# EAGLE design WiFiDMX4Channel (EAGLE 9.4.2)
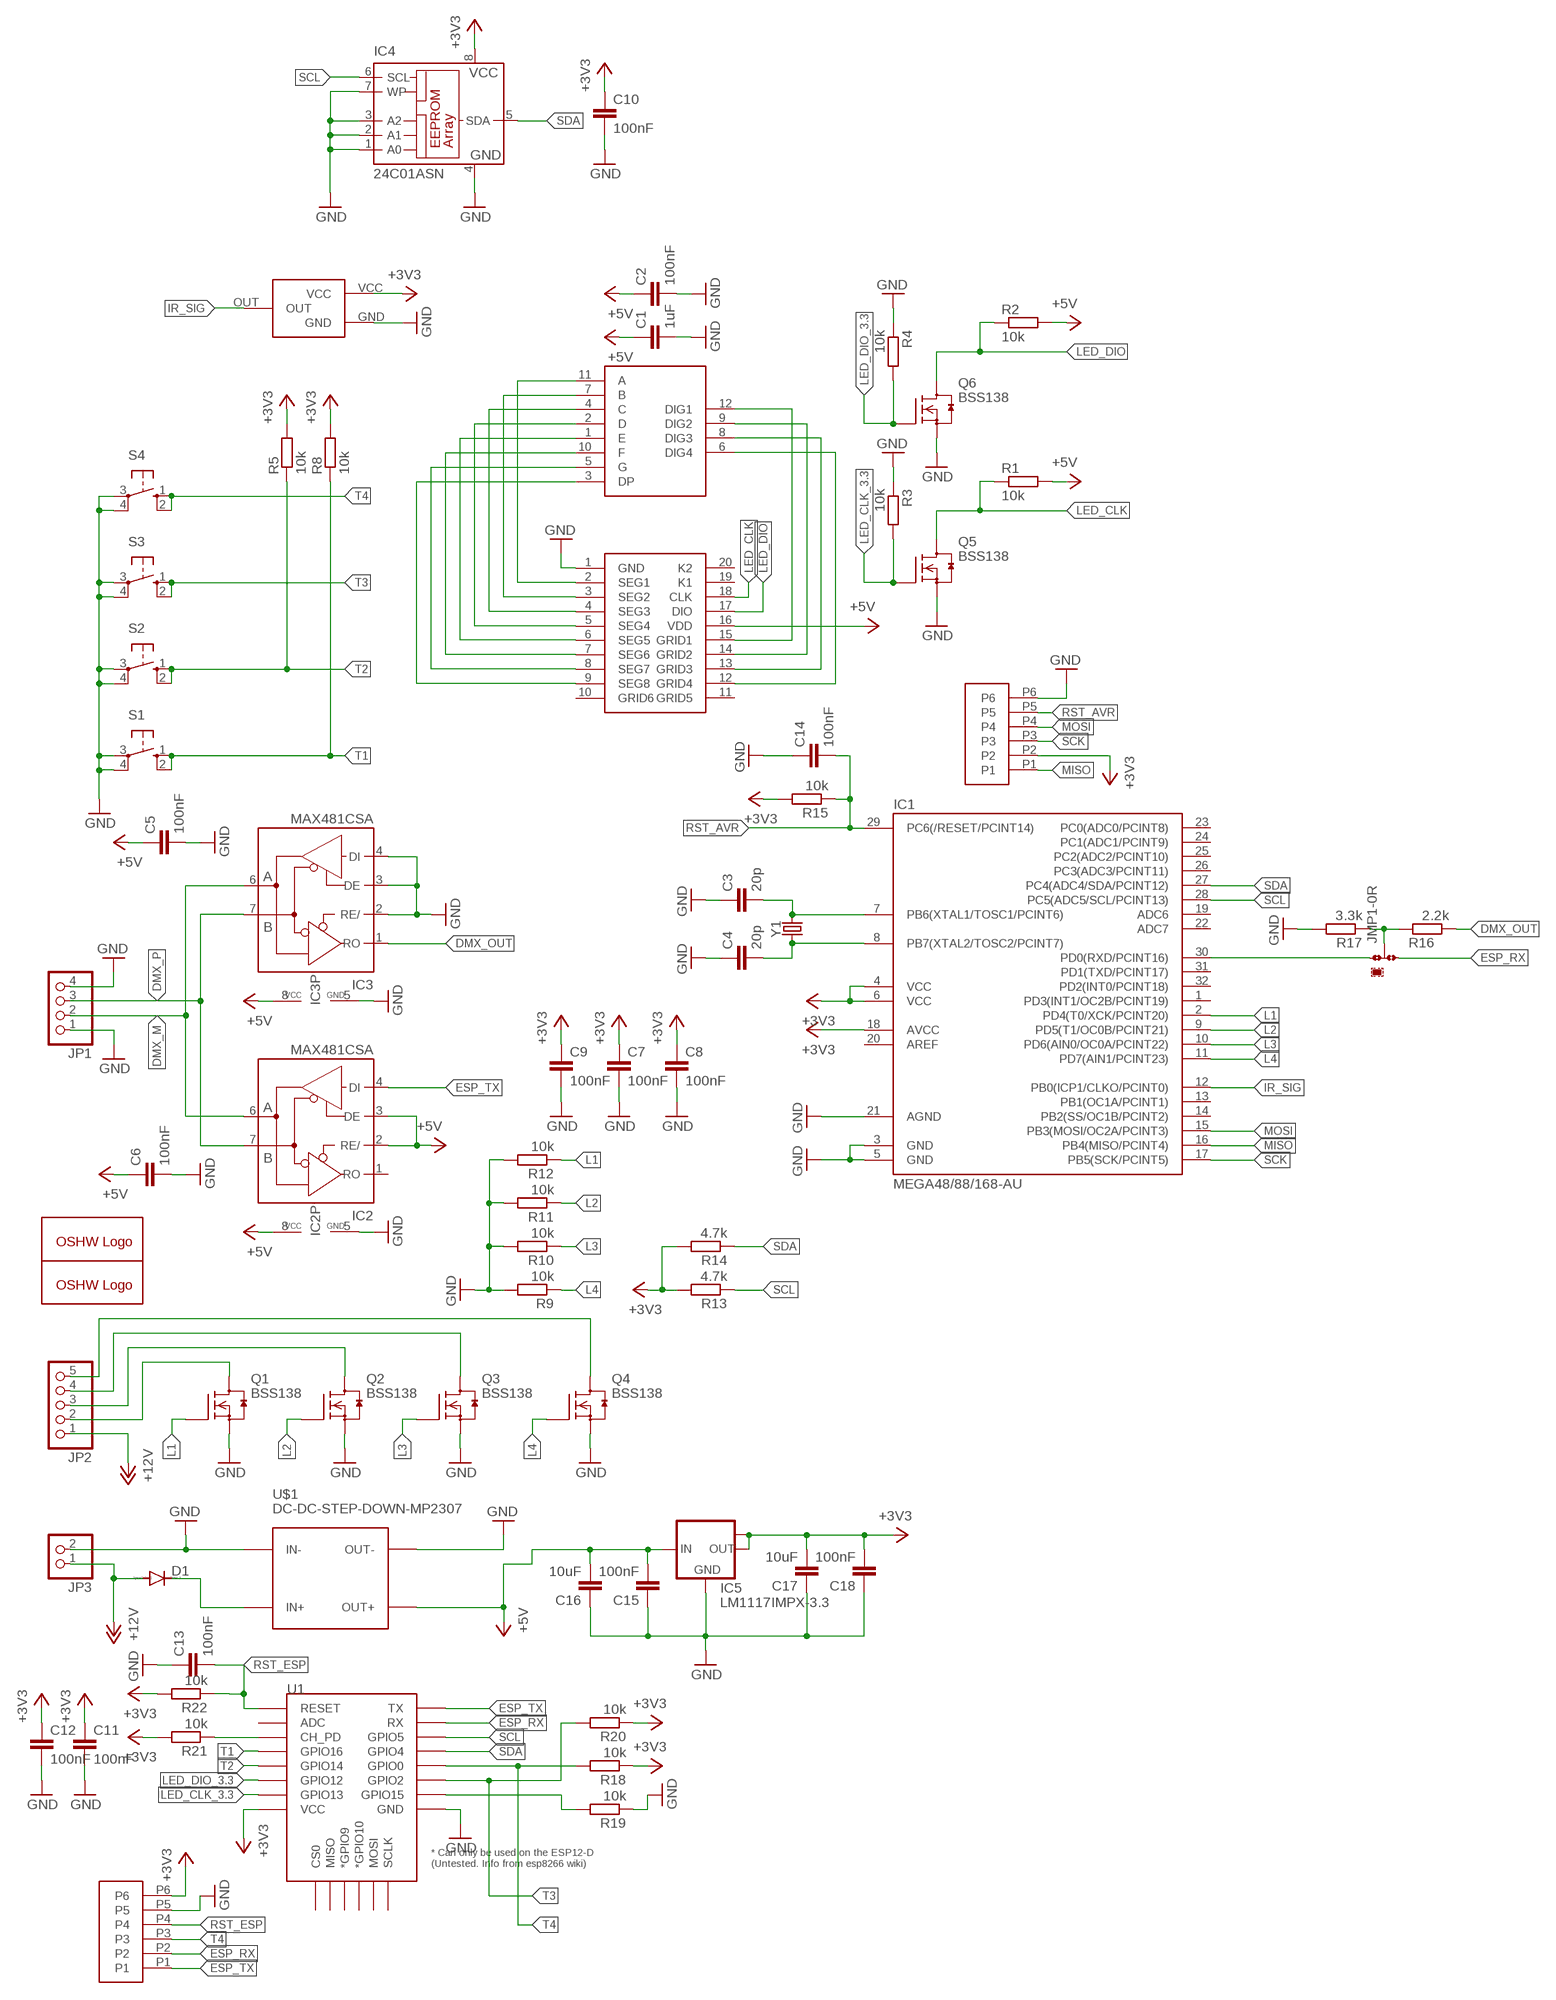
[diagram p0: schematic, sheet 1]

## Parts
C1  1uF  C-EUC0603  [C0603]
C2  100nF  C-EUC0603  [C0603]
C3  20p  C-EUC0603  [C0603]
C4  20p  C-EUC0603  [C0603]
C5  100nF  C-EUC0603  [C0603]
C6  100nF  C-EUC0603  [C0603]
C7  100nF  C-EUC0603  [C0603]
C8  100nF  C-EUC0603  [C0603]
C9  100nF  C-EUC0603  [C0603]
C10  100nF  C-EUC0603  [C0603]
C11  100nF  C-EUC0603  [C0603]
C12  100nF  C-EUC0603  [C0603]
C13  100nF  C-EUC0603  [C0603]
C14  100nF  C-EUC0603  [C0603]
C15  100nF  C-EUC0603  [C0603]
C16  10uF  C-EUC0603  [C0603]
C17  10uF  C-EUC0603  [C0603]
C18  100nF  C-EUC0603  [C0603]
D1  DIODE-DO214AC  [DO214AC]
GOLD_ORB_SM1  OSHWLOGOLOGO5MM  [OSHW_5MM]
GOLD_ORB_SM2  OSHWLOGOLOGO5MM  [OSHW_5MM]
IC1  MEGA48/88/168-AU  [TQFP32-08]
IC2  MAX481CSA  [SO08]
IC3  MAX481CSA  [SO08]
IC4  24C01ASN  [SO-08]
IC5  LM1117IMPX-3.3  [SOT223]
JMP1  0R-JUMPA  [A0R-JMP]
JP1  PINHD-1X4_2.54  [1X04]
JP2  PINHD-1X5_2.54  [1X05]
JP3  PINHD-1X2_2.54  [1X02]
Q1  BSS138  [SOT23]
Q2  BSS138  [SOT23]
Q3  BSS138  [SOT23]
Q4  BSS138  [SOT23]
Q5  BSS138  [SOT23]
Q6  BSS138  [SOT23]
R1  10k  R-EU_R0603  [R0603]
R2  10k  R-EU_R0603  [R0603]
R3  10k  R-EU_R0603  [R0603]
R4  10k  R-EU_R0603  [R0603]
R5  10k  R-EU_R0603  [R0603]
R8  10k  R-EU_R0603  [R0603]
R9  10k  R-EU_R0603  [R0603]
R10  10k  R-EU_R0603  [R0603]
R11  10k  R-EU_R0603  [R0603]
R12  10k  R-EU_R0603  [R0603]
R13  4.7k  R-EU_R0603  [R0603]
R14  4.7k  R-EU_R0603  [R0603]
R15  10k  R-EU_R0603  [R0603]
R16  2.2k  R-EU_R0603  [R0603]
R17  3.3k  R-EU_R0603  [R0603]
R18  10k  R-EU_R0603  [R0603]
R19  10k  R-EU_R0603  [R0603]
R20  10k  R-EU_R0603  [R0603]
R21  10k  R-EU_R0603  [R0603]
R22  10k  R-EU_R0603  [R0603]
S1  10-XX  [B3F-10XX]
S2  10-XX  [B3F-10XX]
S3  10-XX  [B3F-10XX]
S4  10-XX  [B3F-10XX]
U1  ESP12ESMD  [ESP12E-SMD]
U$1  DC-DC-STEP-DOWN-MP2307  [DC-DC-STEP-DOWN-MP2307]
U$2  4-DIGIT-7-SEGMENT  [7SETG-1]
U$3  TM1637-SOP20  [SO20W]
U$4  PC838  [PC838]
U$5  6P-1.27  [6P-1.27]
U$6  6P-1.27  [6P-1.27]
Y1  CRYSTALSMD-5X3.2-2PAD  [CRYSTAL-SMD-5X3.2-2PAD]

## Nets
+3V3: C7.1 C8.1 C9.1 C10.1 C11.1 C12.1 C17.2 C18.2 IC1.4(VCC) IC1.6(VCC) IC1.18(AVCC) IC4.8(VCC) IC5.2(OUT) IC5.TAB(OUT1) R5.2 R8.2 R13.2 R14.2 R15.2 R18.1 R20.1 R21.2 R22.2 U1.VCC U$4.VCC U$5.P6 U$6.P2
+5V: C1.1 C2.1 C5.1 C6.1 C15.2 C16.2 IC2.2(RE/) IC2.3(DE) IC2.8(VCC) IC3.8(VCC) IC5.3(IN) R1.2 R2.2 U$1.OUT+ U$3.16(VDD)
+12V: D1.A JP2.1 JP3.1
AS: R19.2 U1.GPIO15
DMX_M: IC2.6(A) IC3.6(A) JP1.2
DMX_OUT: IC3.1(RO) R16.1
DMX_P: IC2.7(B) IC3.7(B) JP1.3
ESP_RX: JMP1.3 U1.RXD0(RX) U$5.P2
ESP_TX: IC2.4(DI) U1.TXD0(TX) U$5.P1
GND: C1.2 C2.2 C3.1 C4.1 C5.2 C6.2 C7.2 C8.2 C9.2 C10.2 C11.2 C12.2 C13.1 C14.1 C15.1 C16.1 C17.1 C18.1 IC1.3(GND) IC1.5(GND) IC1.21(AGND) IC2.5(GND) IC3.2(RE/) IC3.3(DE) IC3.4(DI) IC3.5(GND) IC4.1(A0) IC4.2(A1) IC4.3(A2) IC4.4(GND) IC4.7(WP) IC5.1(GND) JP1.1 JP1.4 JP3.2 Q1.2(S) Q2.2(S) Q3.2(S) Q4.2(S) Q5.2(S) Q6.2(S) R3.1 R4.1 R9.2 R10.2 R11.2 R12.2 R17.2 R19.1 S1.3(P) S1.4(P1) S2.3(P) S2.4(P1) S3.3(P) S3.4(P1) S4.3(P) S4.4(P1) U1.GND U$1.IN- U$1.OUT- U$3.1(GND) U$4.GND U$5.P5 U$6.P6
IR_SIG: IC1.12(PB0(ICP1/CLKO/PCINT0)) U$4.OUT
L1: IC1.2(PD4(T0/XCK/PCINT20)) Q1.1(G) R12.1
L2: IC1.9(PD5(T1/OC0B/PCINT21)) Q2.1(G) R11.1
L3: IC1.10(PD6(AIN0/OC0A/PCINT22)) Q3.1(G) R10.1
L4: IC1.11(PD7(AIN1/PCINT23)) Q4.1(G) R9.1
LED_CLK: Q5.3(D) R1.1 U$3.18(CLK)
LED_CLK_3.3: Q5.1(G) R3.2 U1.GPIO13
LED_DIO: Q6.3(D) R2.1 U$3.17(DIO)
LED_DIO_3.3: Q6.1(G) R4.2 U1.GPIO12
MISO: IC1.16(PB4(MISO/PCINT4)) U$6.P1
MOSI: IC1.15(PB3(MOSI/OC2A/PCINT3)) U$6.P4
N$1: JP2.5 Q4.3(D)
N$2: JP2.4 Q3.3(D)
N$3: JP2.3 Q2.3(D)
N$4: D1.C U$1.IN+
N$5: C4.2 IC1.8(PB7(XTAL2/TOSC2/PCINT7)) Y1.P$1
N$6: U$2.11(A) U$3.2(SEG1)
N$7: U$2.7(B) U$3.3(SEG2)
N$8: U$2.4(C) U$3.4(SEG3)
N$9: U$2.2(D) U$3.5(SEG4)
N$10: U$2.1(E) U$3.6(SEG5)
N$11: U$2.10(F) U$3.7(SEG6)
N$12: U$2.5(G) U$3.8(SEG7)
N$13: U$2.3(DP) U$3.9(SEG8)
N$14: U$2.12(DIG1) U$3.15(GRID1)
N$15: U$2.9(DIG2) U$3.14(GRID2)
N$16: U$2.8(DIG3) U$3.13(GRID3)
N$17: U$2.6(DIG4) U$3.12(GRID4)
N$18: C3.2 IC1.7(PB6(XTAL1/TOSC1/PCINT6)) Y1.P$2
N$19: JP2.2 Q1.3(D)
N$20: JMP1.2 R16.2 R17.1
N$24: R21.1 U1.CH_PD
N$26: IC1.30(PD0(RXD/PCINT16)) JMP1.1
RST_AVR: C14.2 IC1.29(PC6(/RESET/PCINT14)) R15.1 U$6.P5
RST_ESP: C13.2 R22.1 U1.RESET U$5.P4
SCK: IC1.17(PB5(SCK/PCINT5)) U$6.P3
SCL: IC1.28(PC5(ADC5/SCL/PCINT13)) IC4.6(SCL) R13.1 U1.GPIO5
SDA: IC1.27(PC4(ADC4/SDA/PCINT12)) IC4.5(SDA) R14.1 U1.GPIO4
T1: R8.1 S1.1(S) S1.2(S1) U1.GPIO16
T2: R5.1 S2.1(S) S2.2(S1) U1.GPIO14
T3: R20.2 S3.1(S) S3.2(S1) U1.GPIO2
T4: R18.2 S4.1(S) S4.2(S1) U1.GPIO0 U$5.P3
Unconnected: IC1.1(PD3(INT1/OC2B/PCINT19)) IC1.13(PB1(OC1A/PCINT1)) IC1.14(PB2(SS/OC1B/PCINT2)) IC1.19(ADC6) IC1.20(AREF) IC1.22(ADC7) IC1.23(PC0(ADC0/PCINT8)) IC1.24(PC1(ADC1/PCINT9)) IC1.25(PC2(ADC2/PCINT10)) IC1.26(PC3(ADC3/PCINT11)) IC1.31(PD1(TXD/PCINT17)) IC1.32(PD2(INT0/PCINT18)) IC2.1(RO) U1.ADC U1.CS0 U1.GPIO9(*GPIO9) U1.GPIO10(*GPIO10) U1.MISO U1.MOSI U1.SCLK U$3.10(GRID6) U$3.11(GRID5) U$3.19(K1) U$3.20(K2)

## Library data of the parts
C1-C18 = resistor:C-EU: CAPACITOR, European symbol
D1 = diode:DIODE-: DIODE
GOLD_ORB_SM1 GOLD_ORB_SM2 = oshw:OSHWLOGO: The OSHW logo for PCB layout
IC1 = avr-6:MEGA48/88/168
IC2 IC3 = maxim (1):MAX481CSA: RS485 TRANSEIVER
IC4 = microchip:24C*: Serial EEPROM 1 K/2 K/4 K; MPN: AT24C01BN-SH-B; OC_FARNELL: 1362638; OC_NEWARK: 50M3313
IC5 = lm1117-2:LM1117IMPX-*
JMP1 = jump-0r-smd:0R-JUMP: SMD 0R 0805 Jumper
JP1 = pinhead2:PINHD-1X4: PIN HEADER
JP2 = pinhead2:PINHD-1X5: PIN HEADER
JP3 = pinhead2:PINHD-1X2: PIN HEADER
Q1-Q6 = m-pad-2.1:BSS138: Fairchild Semiconductors BSS138 N-Channel Logic Level Enhancement Mode Field Effect Transistor General Description: These N-Channel enhancement mode field effect transistors are produced using Fairchild's proprietary, high cell density, DMOS technology. These products have been designed to minimize on-state resistance while provide rugged, reliable, and fast switching performance.These products are particularly suited for low voltage, low current applications such as small servo motor control, power MOSFET gate drivers, and other switching applications. Features: 0.22 A, 50 V. RDS(ON) = 3.5Ohm @ VGS = 10 V RDS(ON) = 6.0Ohm @ VGS = 4.5 V High density cell design for extremely low RDS(ON) Rugged and Reliable Compact industry standard SOT-23 surface mount package Please send any comments to: messi@users.sourceforge.net
R1-R5 R8-R22 = resistor:R-EU_: RESISTOR, European symbol
S1-S4 = switch-omron:10-XX: OMRON SWITCH; MPN: B3F-1000; OC_FARNELL: 176432; OC_NEWARK: 36M3542
U1 = esp8266modules:ESP12E: ESP12E Module
U$1 = diy-modules:DC-DC-STEP-DOWN-MP2307: DC/DC Step-Down Regulator based on MP2307DN chip MP2307 datasheet available here: https://cdn-shop.adafruit.com/datasheets/MP2307_r1.9.pdf Click here to find device on ebay.com <http://www.ebay.com/sch/dc+dc+3a+mini+converter>
U$2 = 7seg-1:4-DIGIT-7-SEGMENT
U$3 = wolli:TM1637-SOP20
U$4 = wolli:PC838
U$5 U$6 = wolli:6P-1.27
Y1 = SparkFun-Clocks:CRYSTAL: Crystals (Generic) These are passive quartz crystals, which can be used as a clock source for a microcontroller. Crystal's are two-terminal devices. They require external "load" capacitors to generate an oscillating signal.

## Board
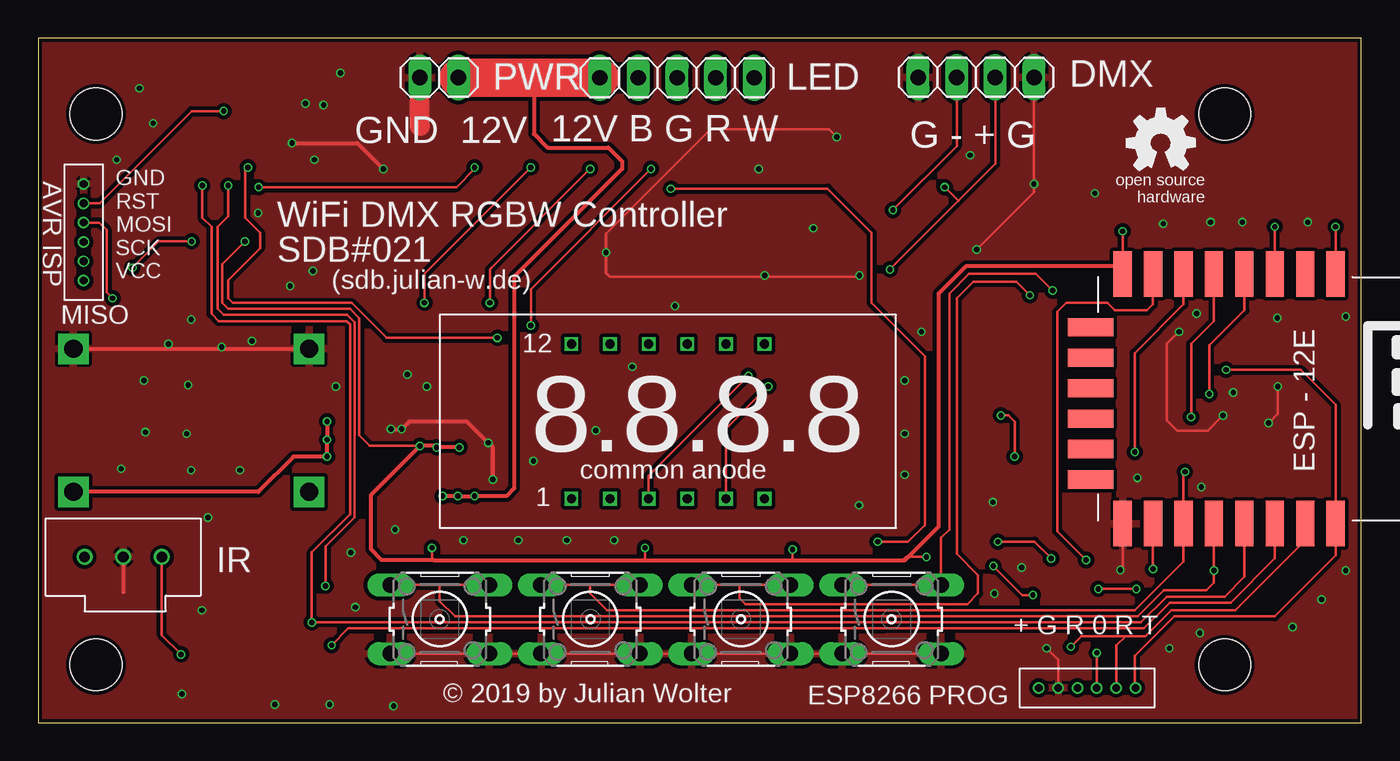
[diagram p1: board, top side]
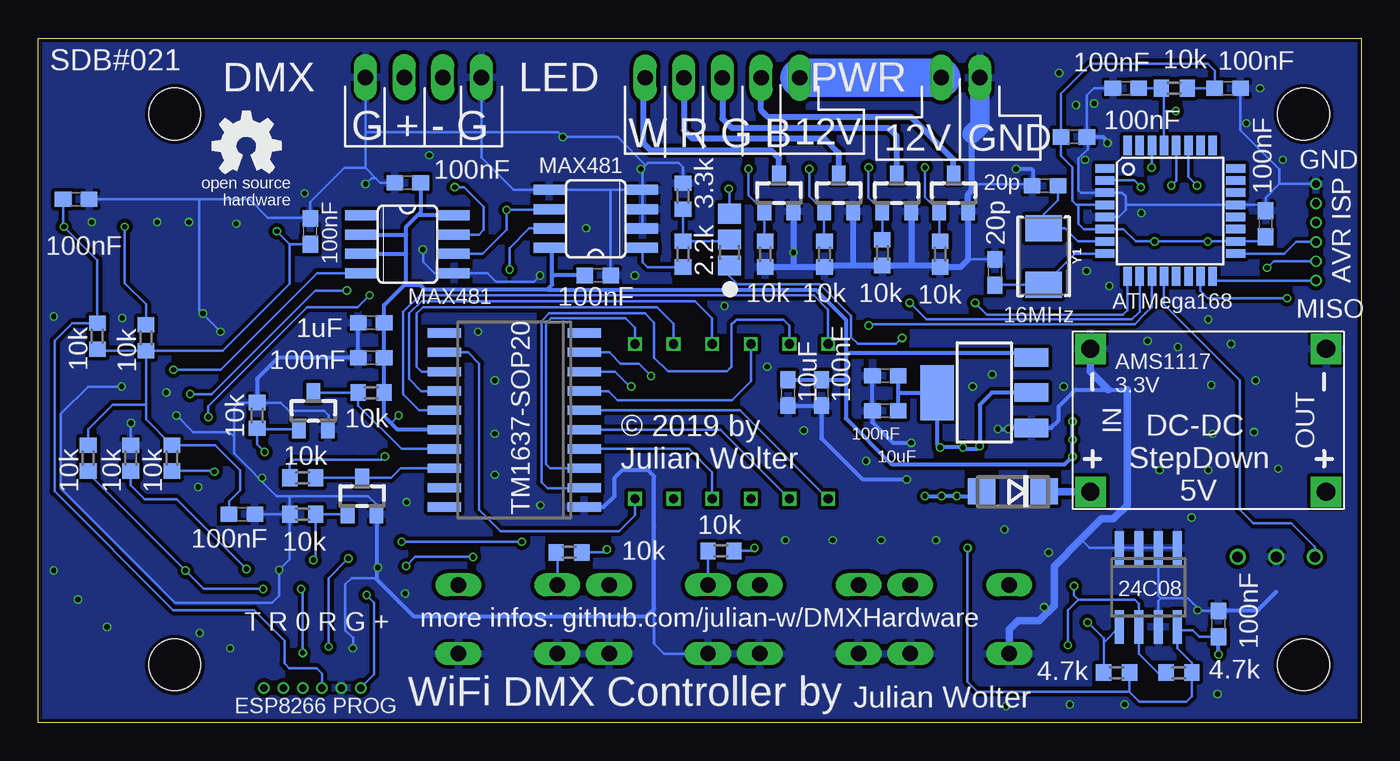
[diagram p2: board, bottom side, seen from below]

Size 87 x 45 mm. Coordinates in mm from the lower left corner, seen from the top.
Outline: 0,0 87,0 87,45 0,45 0,0
Copper layers (1*16): Top 0.018mm / dielectric 1.55mm / Bottom 0.018mm
Design rules "Multi-CB_2L_100µm-Tracks_OL35µm": minimum track width 0.1mm, minimum drill 0.2mm, track to track 0.1mm, track to pad 0.1mm, pad to pad 0.1mm, via to via 0.1mm, smd to smd 0mil, copper to edge 0.2mm, drill to drill 0.2mm, minimum pad ring 0.125mm, minimum via ring 0.1mm, stop-mask expansion 2mil, vias tented up to drill 0.45mm, thermal gap 0.2mm
Holes 3.4 mm at 3.81,40.01 3.81,3.81 78.01,3.81 78.01,40.01

### Footprints (pad centres in the part's own frame; a part is rotated, then mirrored left to right if it is on the bottom)
C0603 = smd 1.1 x 1: 1 -0.85,0; 2 0.85,0
DO214AC = smd 1.8 x 1.7: A 2.05,0; C -2.05,0
TQFP32-08 = smd 1.27 x 0.559: 1 -4.293,2.8; 2 -4.293,2; 3 -4.293,1.2; 4 -4.293,0.4; 5 -4.293,-0.4; 6 -4.293,-1.2; 7 -4.293,-2; 8 -4.293,-2.8; 17 4.293,-2.8; 18 4.293,-2; 19 4.293,-1.2; 20 4.293,-0.4; 21 4.293,0.4; 22 4.293,1.2; 23 4.293,2; 24 4.293,2.8 | smd 0.559 x 1.27: 9 -2.8,-4.293; 10 -2,-4.293; 11 -1.2,-4.293; 12 -0.4,-4.293; 13 0.4,-4.293; 14 1.2,-4.293; 15 2,-4.293; 16 2.8,-4.293; 25 2.8,4.293; 26 2,4.293; 27 1.2,4.293; 28 0.4,4.293; 29 -0.4,4.293; 30 -1.2,4.293; 31 -2,4.293; 32 -2.8,4.293
SO08 = smd 0.66 x 2.032: 1 -1.905,-3.073; 2 -0.635,-3.073; 3 0.635,-3.073; 4 1.905,-3.073; 5 1.905,3.073; 6 0.635,3.073; 7 -0.635,3.073; 8 -1.905,3.073
SO-08 = smd 0.6 x 2.2: 1 -1.905,-2.6; 2 -0.635,-2.6; 3 0.635,-2.6; 4 1.905,-2.6; 5 1.905,2.6; 6 0.635,2.6; 7 -0.635,2.6; 8 -1.905,2.6
SOT223 = smd 1.219 x 2.235: 1 -2.311,-3.099; 2 0,-3.099; 3 2.311,-3.099 | smd 3.6 x 2.2: TAB 0,3.099
A0R-JMP = smd 1.5 x 1.3: 1 0,1.7; 2 0,0; 3 0,-1.7
1X04 = drill 1.016 long: 1 -3.81,0; 2 -1.27,0; 3 1.27,0; 4 3.81,0
1X05 = drill 1.016 long: 1 -5.08,0; 2 -2.54,0; 3 0,0; 4 2.54,0; 5 5.08,0
1X02 = drill 1.016 long: 1 -1.27,0; 2 1.27,0
SOT23 = smd 0.9 x 1.2: 1 -0.95,-1.2; 2 0.95,-1.2; 3 0,1.2
R0603 = smd 1 x 1.1: 1 -0.85,0; 2 0.85,0
B3F-10XX = drill 1.016 long: 1 -3.251,2.261; 2 3.251,2.261; 3 -3.251,-2.261; 4 3.251,-2.261
ESP12E-SMD = smd 3 x 1.2: ADC -8.3,3.8; CH_PD -8.3,1.8; GND 8.1,-8.2; GPIO0 8.1,-2.2; GPIO2 8.1,-4.2; GPIO4 8.1,-0.2; GPIO5 8.1,1.8; GPIO12 -8.3,-4.2; GPIO13 -8.3,-6.2; GPIO14 -8.3,-2.2; GPIO15 8.1,-6.2; GPIO16 -8.3,-0.2; RESET -8.3,5.8; RXD0 8.1,3.8; TXD0 8.1,5.8; VCC -8.3,-8.2 | smd 1.2 x 3: CS0 -4.8,-10.3; GPIO9 -0.8,-10.3; GPIO10 1.2,-10.3; MISO -2.8,-10.3; MOSI 3.2,-10.3; SCLK 5.2,-10.3
DC-DC-STEP-DOWN-MP2307 = drill 1.2 pad 2 square: IN+ -7.747,-4.699; IN- -7.747,4.699; OUT+ 7.747,-4.699; OUT- 7.747,4.699
7SETG-1 = drill 0.6 square: 1 8.65,1.92; 2 11.19,1.92; 3 13.73,1.92; 4 16.27,1.92; 5 18.81,1.92; 6 21.35,1.92; 7 21.35,12.08; 8 18.81,12.08; 9 16.27,12.08; 10 13.73,12.08; 11 11.19,12.08; 12 8.65,12.08
SO20W = smd 0.6 x 2.2: 1 -5.715,-4.6; 2 -4.445,-4.6; 3 -3.175,-4.6; 4 -1.905,-4.6; 5 -0.635,-4.6; 6 0.635,-4.6; 7 1.905,-4.6; 8 3.175,-4.6; 9 4.445,-4.6; 10 5.715,-4.6; 11 5.715,4.6; 12 4.445,4.6; 13 3.175,4.6; 14 1.905,4.6; 15 0.635,4.6; 16 -0.635,4.6; 17 -1.905,4.6; 18 -3.175,4.6; 19 -4.445,4.6; 20 -5.715,4.6
PC838 = drill 0.7: GND 0,0; OUT -2.54,0; VCC 2.54,0
6P-1.27 = drill 0.5: P1 -2.54,0; P2 -1.27,0; P3 0,0; P4 1.27,0; P5 2.54,0; P6 3.81,0
CRYSTAL-SMD-5X3.2-2PAD = smd 1.7 x 2.4: P$1 1.85,0; P$2 -1.85,0

### Placement (x,y rotation side)
C1  65.1,26.3 180 bottom
C2  65.1,24 180 bottom
C3  20.8,35.3 0 bottom
C4  24.1,29.6 270 bottom
C5  50.2,29.4 0 bottom
C6  62.7,35.5 180 bottom
C7  6.3,32.8 90 bottom
C8  18.9,38.5 0 bottom
C9  8.8,41.7 0 bottom
C10  9.4,6.5 90 bottom
C11  73.6,13.7 0 bottom
C12  69.1,32.3 90 bottom
C13  84.5,34.4 180 bottom
C14  15.5,41.7 0 bottom
C15  35.5,21.7 90 bottom
C16  37.7,21.7 90 bottom
C17  31.3,20.5 0 bottom
C18  31.3,22.8 0 bottom
D1  22.91,15.21 180 bottom
GOLD_ORB_SM1  73.8,38.1 0 top
GOLD_ORB_SM2  73.3,37.9 0 bottom
IC1  12.58,33.64 0 bottom
IC2  62.71,31.45 270 bottom
IC3  50.34,33.12 90 bottom
IC4  14,8.9 180 bottom
IC5  24.8,21.7 90 bottom
JMP1  41.55,31.76 180 bottom
JP1  61.66,42.42 0 top
JP2  42.01,42.39 0 top
JP3  26.36,42.4 180 top
Q1  26.81,34.81 0 bottom
Q2  30.55,34.81 0 bottom
Q3  34.37,34.81 0 bottom
Q4  38.29,34.81 0 bottom
Q5  65.7,14.9 0 bottom
Q6  68.9,20.5 0 bottom
R1  69.6,16.1 180 bottom
R2  65.1,21.7 0 bottom
R3  69.6,13.7 0 bottom
R4  72.6,20.2 270 bottom
R5  42.1,11.3 0 bottom
R8  52.1,11.2 0 bottom
R9  39.2,30.8 270 bottom
R10  35.3,30.8 270 bottom
R11  31.5,30.9 270 bottom
R12  27.7,30.8 270 bottom
R13  12,3.3 0 bottom
R14  16.1,3.3 0 bottom
R15  12.3,41.7 0 bottom
R16  44.6,30.8 90 bottom
R17  44.6,34.6 90 bottom
R18  83.7,17.4 270 bottom
R19  80.9,17.4 270 bottom
R20  78.2,17.4 270 bottom
R21  79.9,25.3 270 bottom
R22  83.1,25.4 270 bottom
S1  56.11,6.81 0 top
S2  46.21,6.81 0 top
S3  36.31,6.81 0 top
S4  26.41,6.81 0 top
U1  79.5,21.19 270 top
U$1  10.07,19.88 0 bottom
U$2  26.41,12.81 0 top
U$3  55.7,19.9 90 bottom
U$4  5.6,10.9 0 top
U$5  69.6,2.3 180 top
U$6  3,31.6 90 top
Y1  20.89,30.65 270 bottom

### Tracks (layer width: path | path; a pad name or v marks a point on that pad's centre or on a via)
+3V3  (via drill 0.35)
  Top 0.152: U1.VCC v71.3,32.3 | v49.6,11.4 49.6,10.7 | v39.9,11.5 39.9,10.7 | 56.9,10.7 57.1,10.9 v58.4,10.9 | v62.8,10.3 64.7,8.4 v65.4,8.4 | v25.9,11.5 25.9,10.8 26,10.7 | v6.2,29.91 7.93,31.64 v10.1,31.64 | v13.6,31.64 12.11,30.14 12.11,27.59 12.5,27.2 20.5,27.2 21.11,26.59 21.11,18.89 21.8,18.2 v25.1,18.2 | v9.4,4.5 8.14,5.76 U$4.VCC
  Top 0.254: U1.VCC 70.8,29.99 60.99,29.99 59.4,28.4 59.2,28.2 59.2,17.6 59.2,12.9 57,10.7 56.9,10.7 49.6,10.7 39.9,10.7 26,10.7 22.6,10.7 21.9,11.4 21.9,15 v25.1,18.2 26.1,18.2 v26.2,18.1 v27.7,18.1 | 9.4,4.56 v9.4,4.5
  Bottom 0.152: R21.2 83,24.45 R22.2 | 79.9,20.9 79.9,21.5 R21.2 | 79.9,20.9 79.9,19.95 R20.1 75.35,18.25 73.7,16.6 73.7,15.3 74.45,14.55 C11.1 | R14.2 15.25,2.05 | 15.25,2.05 14.6,1.4 11.5,1.4 11.15,1.75 R13.2 11.15,3.95 12.1,4.89 12.1,6.1 | 12.1,6.1 IC4.8 | C10.1 10.65,5.65 11.1,6.1 12.1,6.1 | v71.3,32.3 70.45,31.45 | 70.45,31.45 C12.1 | 70.45,31.45 70.45,28.85 74.85,24.45 R21.2 | R18.1 83.7,19.3 82.1,20.9 79.9,20.9 | R8.2 49.8,11.2 v49.6,11.4 | R5.2 40.1,11.3 v39.9,11.5 | v58.4,10.9 62.2,10.9 v62.8,10.3 | v65.4,8.4 64.9,7.9 64.9,3.19 U$5.P6 | 15.25,2.05 25.25,2.05 25.9,2.7 v25.9,11.5 | IC1.4 18.6,34.04 | 18.6,34.04 18.74,34.04 19,34.3 19,36.5 19.75,37.25 19.75,38.4 | 19.75,38.4 C8.1 | 18.6,34.04 18.6,32.8 18.24,32.44 IC1.6 15.64,32.44 14.84,31.64 13.9,31.64 | v13.6,31.64 v10.1,31.64 IC1.18 6.61,31.64 C7.1 | v13.6,31.64 13.9,31.64 | U$6.P2 5.78,30.33 v6.2,29.91 | R15.2 C9.1 9.65,42.85 10.1,43.3 17.8,43.3 19.75,41.35 19.75,38.4 | 13.9,31.64 v13.6,31.64
  Bottom 0.254: v9.4,4.5 C10.1 | IC5.2 24.3,21.7 25.1,20.9 v25.1,18.2 25.3,18 26.1,18 v26.2,18.1 v27.7,18.1 27.9,18.3 IC5.TAB 30.45,21.7 | C17.2 30.45,21.7 | 30.45,21.7 C18.2
+5V  (via drill 0.35)
  Top 0.152: v64.2,17.5 64.2,19.8 63.8,20.2 v63.3,20.2
  Top 0.254: v19,19.8 v19,18.6 v19,17.5 16.8,17.5 14.48,15.18 U$1.OUT+
  Bottom 0.152: R1.2 70.45,17.05 70.2,17.3 66.3,17.3 64.4,17.3 v64.2,17.5 | v63.3,20.2 63.8,19.7
  Bottom 0.254: U$3.16 63.37,19.27 63.8,19.7 64.25,20.15 R2.2 C2.1 C1.1 64.25,27.45 62.9,28.8 | 62,33.4 62.8,32.6 62.8,32.1 | 62,33.4 59.68,33.4 IC2.8 | 62.9,28.8 62.8,28.9 62.8,30.8 | 62.8,30.8 62.8,32.1 | C6.1 61.85,33.55 62,33.4 | IC2.2 62.81,32.09 62.8,32.1 | IC2.3 62.81,30.82 62.8,30.8 | 62.9,28.8 61.9,28.8 61.6,28.5 53.5,28.5 | 53.5,28.5 53.2,28.8 53.2,29.3 | 53.2,29.3 53.2,31 IC3.8 | C5.1 53.1,29.4 53.2,29.3 | 53.5,28.5 53.46,28.46 35.85,28.46 33.9,26.5 33.9,24.3 | v19,19.8 v19,18.6 v19,17.5 19.5,17 30.9,17 33.9,20 33.9,22.6 | 33.9,24.3 33.9,22.6 | IC5.3 21.99,24.3 33.9,24.3 | C16.2 C15.2 33.95,22.55 33.9,22.6
+12V  (via drill 0.35)
  Top 0.254: 32.6,42.4 32.6,38.7 33.5,37.8 37.5,37.8 38.4,36.9 38.4,36.4 31.3,29.3 31.3,15.4 30.8,14.9 v28.7,14.9 v27.6,14.9 v26.6,14.9
  Top 2.54: JP3.1 32.6,42.4 JP2.1
  Bottom 0.254: v28.7,14.9 v27.6,14.9 v26.6,14.9 25.27,14.9 D1.A
  Bottom 2.54: JP3.1 JP2.1
AS  (via drill 0.35)
  Top 0.152: U1.GPIO15 v73.3,10.1
  Bottom 0.152: v73.3,10.1 77.9,14.7 80,14.7 80.9,15.6 R19.2
DMX_M  (via drill 0.35)
  Top 0.152: JP1.2 60.39,37.89 v56.2,33.7
  Bottom 0.152: IC3.6 53.47,33.7 v56.2,33.7 56.2,32.4 57.78,30.82 IC2.6
DMX_OUT
  Bottom 0.152: R16.1 46.95,29.95 47.27,30.27 IC3.1
DMX_P  (via drill 0.35)
  Top 0.152: v56,29.8 60.5,34.3 | 60.5,34.3 62.93,36.73 JP1.3 | v59.6,35.2 60.5,34.3
  Bottom 0.152: IC3.7 54.72,32.48 56,31.2 v56,29.8 | IC2.7 58.02,32.09 57.7,32.4 57.7,33.9 59,35.2 v59.6,35.2
ESP_RX  (via drill 0.35)
  Top 0.152: v41.6,35.1 51.9,35.1 54.8,32.2 54.8,27.6 58.3,24.1 58.3,13 57.2,11.9 v55.2,11.9 | v63.1,11.9 65.5,11.9 v66.6,10.8 | U1.RXD0 83.3,12 78.7,7.4 74.5,7.4 72.8,5.7 71.5,5.7 | 71.5,5.7 70.9,5.1 70.9,2.33 U$5.P2 | v67.9,5 68.6,5.7 71.5,5.7
  Bottom 0.152: JMP1.3 41.55,35.05 v41.6,35.1 | v55.2,11.9 v63.1,11.9 | v66.6,10.8 67.9,9.5 v67.9,5
ESP_TX  (via drill 0.35)
  Top 0.152: v78.1,23.2 83,23.2 85.3,20.9 U1.TXD0 85.3,11 81.3,7 74.7,7 72.1,4.4 72.1,2.34 U$5.P1
  Bottom 0.152: IC2.4 68.66,29.55 75,23.2 v78.1,23.2
GND  (via drill 0.35)
  Top 0.152: U1.GND 71.3,10.2 v71.15,10.05 | v61.7,31.1 65.47,34.87 v65.47,35.4 | v65.47,35.4 65.47,36.2 | 65.47,36.2 JP1.4 | v81.5,22.1 81.5,20.3 v80.9,19.7 | S1.4 S1.3 S2.4 S2.3 S3.4 S3.3 S4.4 S4.3 | U$5.P5 67.06,4.14 v66.3,4.9 | v52.5,38.5 52,39 44.2,39 37.34,32.14 v37.34,30.9 37.34,29.56 37.6,29.3 53.9,29.3 v54,29.4 | 25.3,39 25.1,39.2 | 65.47,36.2 v65.47,35.4 | v77.9,20.2 76.9,19.2 74.9,19.2 74.2,19.9 74.2,24.9 v75,25.7
  Top 0.254: U$1.OUT- U$1.IN- | U$4.GND 5.6,8.6 | v23.2,19.3 v23.9,19.3 24.4,19.8 28.2,19.8 v29.6,18.4 29.9,18.1 v29.9,16 | v16.7,38.1 21,38.1 v22.7,36.4
  Top 1.27: 25.1,39.2 25.09,39.21 JP3.2
  Bottom 0.152: Q6.2 67.9,19.35 67.9,20.2 68.2,20.5 70.5,20.5 71.05,21.05 R4.1 73.75,21.05 74.1,20.7 74.1,18.8 | Q5.2 64.75,14.35 65.3,14.9 70.6,14.9 | 70.6,14.9 71.3,14.9 74.1,17.7 74.1,18.8 | R3.1 70.45,10.75 v71.15,10.05 71.15,8.35 71.6,7.9 78,7.9 85.5,15.4 85.5,20.3 83.7,22.1 v81.5,22.1 | R3.1 70.45,14.75 70.6,14.9 | IC4.7 13.37,8.04 13.2,8.2 | 13.2,8.2 11.4,8.2 10.55,7.35 C10.2 | IC4.1 IC4.2 | IC4.2 IC4.3 IC4.4 17.9,11.5 18.45,12.05 | IC4.2 13.37,8.37 13.2,8.2 | 57.85,38.8 57.85,37.15 55.73,35.02 IC3.5 49.4,35.02 | 57.85,38.8 JP1.1 | IC3.4 49.4,35.02 | IC3.4 IC3.3 IC3.2 | C5.2 49.35,34.98 49.4,35.02 | v61.7,31.1 61.7,30.3 60.95,29.55 IC2.5 57.45,29.55 56.9,29 54.4,29 v54,29.4 | C6.2 64.5,35.5 64.8,35.8 | 65.47,36.47 65.47,38.8 | 65.47,38.8 JP1.4 | 64.8,35.8 65.47,36.47 | 57.85,38.8 65.47,38.8 | R17.2 44.6,36.3 44.6,36.5 44.9,36.8 46.9,36.8 47.05,36.65 | IC3.4 47.27,36.43 47.05,36.65 | C11.2 R3.1 | R9.2 37.3,29.95 35.4,29.95 R10.2 31.6,29.95 R11.2 | C12.2 69.1,33.2 | 69.1,33.2 69.1,34.2 66.83,36.47 65.47,36.47 | R19.1 v80.9,19.7 | 46.5,7.5 46.5,5.2 45.85,4.55 S2.3 | C13.1 76.5,34.4 | 76.5,34.4 73.1,34.4 71.9,33.2 69.1,33.2 | 63.3,7.9 63.2,7.9 | v66.3,4.9 66.3,5.6 66.8,6.1 66.8,9.1 66.4,9.5 64.75,9.5 | 47.05,36.65 48.85,38.45 48.9,38.5 v52.5,38.5 52.8,38.8 57.85,38.8 | C14.1 17.6,41.7 18.05,41.25 C8.2 18,38.45 18,37.7 18.6,37.1 18.6,35 18.44,34.84 IC1.3 15.74,34.84 15.5,34.6 15.5,34.1 | IC1.5 15.96,33.24 15.5,33.7 15.5,34.1 | C3.1 21.73,35.38 21.75,35.4 25.6,35.4 | C4.1 25.85,30.45 25.86,30.44 | 15.5,34.1 15.44,34.04 IC1.21 6.69,34.04 C7.2 6.3,34.5 5.39,35.41 | U$6.P6 5.39,35.41 | C9.2 7.95,38.95 5.39,36.39 5.39,35.41
  Bottom 0.152: 64.8,35.8 65.07,35.8 v65.47,35.4 | 74.1,18.8 74.4,19.1 76.8,19.1 v77.9,20.2 | v75,25.7 76.4,27.1 76.4,34.3 76.5,34.4
  Bottom 0.254: U$3.1 49.81,14.19 49.1,14.9 49.1,16.1 48.6,16.6 46.9,16.6 46.5,16.2 46.5,12.9 46.5,11.1 46.5,7.5 47,7 62.3,7 63.2,7.9 64.75,9.45 64.75,9.5 Q5.2 | C1.2 C2.2 71.2,24 72.6,22.6 R4.1 | C10.2 6.85,7.35 5.6,8.6 | 15.4,21.9 16.64,21.9 18.8,21.9 19.9,20.8 19.9,19.9 20.41,19.39 IC5.1 23.11,19.39 v23.2,19.3 v23.9,19.3 | C18.1 C17.1 32.15,19.75 30.8,18.4 v29.6,18.4 | C16.1 C15.1 35.5,18.7 32.8,16 v29.9,16 | C8.2 17,38.5 16.7,38.2 v16.7,38.1 | v22.7,36.4 21.7,36.4 21.6,36.3 21.6,35.5 21.73,35.38
  Bottom 0.406: 29.6,30.05 27.8,30.05 R12.2 26.35,29.95 25.86,30.44 Q1.2 25.86,34.74 25.6,35 25.6,35.4 25.6,38.7 25.6,38.9 | 29.6,30.05 R11.2 33.5,30.05 | 33.5,30.05 35.3,30.05 35.4,29.95 | R10.2 37.3,29.95 | 37.3,29.95 R9.2 | Q4.2 v37.34,30.9 37.34,29.99 37.3,29.95 | Q3.2 33.42,30.13 33.5,30.05 | Q2.2 29.6,30.05
  Bottom 0.508: U$1.IN- 17.82,23.08 16.64,21.9 | S4.3 23.16,6.14 22.6,6.7 21.2,6.7 20.2,7.7 20.2,10.3 18.45,12.05 17.1,13.4 16.3,13.4 15.4,14.3 15.4,21.9
  Bottom 1.27: JP3.2 25.09,39.21 25.6,38.7
  other vias: 62.77,14.5 62.87,8.5 64.67,10.2 27.97,12 31.57,12 34.77,12 37.87,12 23.47,12.7 20.87,7.6 20.57,11.2 5.47,16.7 10.07,16.6 11.17,13.5 13.27,16.6 9.77,19 9.87,22.2 7.07,19.1 6.97,22.5 8.57,24.9 12.07,24.7 10.07,26.5 16.57,28.7 18.07,29.7 18.77,40.6 19.87,42.7 7.57,39.4 5.17,37 6.67,41.7 17.57,40.7 18.17,37 14.07,25.1 24.27,22.9 25.57,22.1 19.57,22.1 32.57,17.2 36.67,19.2 39.07,23.4 41.87,27.4 47.77,29.4 58.07,25.7 56.97,22.5 56.97,19 56.97,16.3 53.97,14.3 72.27,16.1 76.17,26.9 78.57,21.7 76.47,15.5 74.37,4.9 76.37,5.9 82.47,6.3 84.37,8.1 85.97,10 85.97,26.7 81.47,26.6 73.97,32.8 77.07,32.9 79.17,32.9 83.47,32.9 69.47,34.8 61.27,37.3 50.97,32.5 47.37,36.4 10.77,7.4 9.47,1.9 15.57,1.2 19.17,1.2 23.37,1.1 14.47,33.5
  pour Top (isolate 0.254): -0.9,-1.3 88.1,-1.3 88.1,46.6 -1.1,46.6 -1.1,-1.2
  pour Bottom (isolate 0.254): -0.8,-0.8 88.2,-0.8 88.2,47.1 -1,47.1 -1,-0.7
IR_SIG
  Bottom 0.152: IC1.12 13,29.33 13,27.5 8,22.5 8,14 7.1,13.1 4.6,13.1 3.06,11.56 U$4.OUT
L1  (via drill 0.35)
  Top 0.152: v28.7,36.5 28.7,36.4 27.5,35.2 v14.5,35.2
  Bottom 0.152: R12.1 27.76,31.71 Q1.1 28.7,34.55 v28.7,36.5 | IC1.2 14.94,35.64 v14.5,35.2
L2  (via drill 0.35)
  Top 0.152: v32.4,36.5 25.4,29.5 v25.4,27.6
  Bottom 0.152: R11.1 Q2.1 32.4,34.51 v32.4,36.5 | IC1.9 15.38,27.12 15.69,26.81 24.61,26.81 v25.4,27.6
L3  (via drill 0.35)
  Top 0.152: v36.3,36.4 29.8,29.9 29.7,29.8 v29.7,27.6
  Bottom 0.152: R10.1 35.32,31.67 Q3.1 36.3,34.59 v36.3,36.4 | IC1.10 14.58,27.02 15.1,26.5 28.61,26.5 v29.7,27.6
L4  (via drill 0.35)
  Top 0.152: v32.4,26.1 32.4,28.5 v40.3,36.4
  Bottom 0.152: R9.1 39.24,31.69 Q4.1 40.3,34.67 v40.3,36.4 | IC1.11 13.78,27.32 14.2,26.9 14.9,26.2 20.3,26.2 32.3,26.2 v32.4,26.1
LED_CLK
  Bottom 0.152: U$3.18 63.17,16.73 63.8,16.1 Q5.3 R1.1
LED_CLK_3.3  (via drill 0.35)
  Top 0.152: v68.9,10.7 67,12.6 67,27 67.6,27.6 70.3,27.6 70.8,27.1 72.9,27.1 73.3,27.5 U1.GPIO13
  Bottom 0.152: Q5.1 R3.2 68.75,10.85 v68.9,10.7
LED_DIO
  Bottom 0.152: U$3.17 63.09,18 65.95,20.85 R2.1 Q6.3
LED_DIO_3.3  (via drill 0.35)
  Top 0.152: v72.1,17.8 72.1,24.3 75.3,27.5 U1.GPIO12
  Bottom 0.152: Q6.1 72.55,19.3 R4.2 72.6,18.3 v72.1,17.8
MISO
  Bottom 0.152: IC1.16 9.49,29.06 U$6.P1
MOSI  (via drill 0.35)
  Top 0.152: U$6.P4 4.03,32.87 4.5,32.4 4.5,28.3 v4.9,27.9
  Bottom 0.152: v4.9,27.9 10.1,27.9 10.58,28.38 IC1.15
N$1
  Bottom 0.406: Q4.3 38.29,37.09 38.8,37.6 46.7,37.6 47.2,38.1 47.2,42.28 JP2.5
N$2
  Bottom 0.406: JP2.4 44.55,38.95 44,38.4 35.3,38.4 34.37,37.47 Q3.3
N$3
  Bottom 0.406: JP2.3 42.01,39.71 41.4,39.1 31.1,39.1 30.55,38.55 Q2.3
N$4
  Bottom 0.508: D1.C 20.83,15.18 U$1.IN+
N$5
  Bottom 0.152: C4.2 24.05,28.8 Y1.P$1 18.85,30.84 IC1.8
N$6
  Bottom 0.152: U$2.11 37.6,26.1 38,26.5 41.1,26.5 41.2,26.4 41.4,26.2 41.4,25.2 41.4,23.4 41.5,23.3 41.7,23.1 45.6,23.1 46.5,24 46.5,26.3 47.1,26.9 53.4,26.9 53.9,26.4 53.9,15.8 53.5,15.4 51.16,15.4 U$3.2
N$7
  Bottom 0.152: U$3.3 53.33,16.73 53.59,17 53.59,26.27 53.28,26.58 48.38,26.58 47.76,25.96 U$2.7
N$8
  Bottom 0.152: U$2.4 42.68,16.48 44.2,18 U$3.4
N$9
  Bottom 0.152: U$2.2 42.13,19.27 U$3.5
N$10
  Bottom 0.152: U$2.1 40.87,20.54 U$3.6
N$11
  Bottom 0.152: U$3.7 49.5,21.8 48.9,21.2 41.4,21.2 40.14,22.46 U$2.10
N$12  (via drill 0.35)
  Top 0.152: v48,22.11 45.22,19.33 U$2.5
  Bottom 0.152: U$3.8 49.08,23.07 48.11,22.11 v48,22.11
N$13  (via drill 0.35)
  Top 0.152: v46.7,22.8 40.14,16.24 U$2.3
  Bottom 0.152: U$3.9 49.45,24.34 48.7,23.6 47.5,23.6 v46.7,22.8
N$14
  Bottom 0.152: U$3.15 61.94,20.54 63,21.6 63,27 61.9,28.1 36,28.1 35.06,27.16 U$2.12
N$15
  Bottom 0.152: U$3.14 61.8,21.8 62.6,22.6 62.6,26.9 61.8,27.7 43.8,27.7 42.68,26.58 U$2.9
N$16
  Bottom 0.152: U$3.13 61.77,23.07 62.1,23.4 62.1,26.9 61.7,27.3 46.3,27.3 45.22,26.22 U$2.8
N$17
  Bottom 0.152: U$2.6 47.76,13.64 48.8,12.6 56.6,12.6 58,14 58,23.6 58.74,24.34 U$3.12
N$18
  Bottom 0.152: C3.2 19.95,34.35 20.89,33.41 Y1.P$2 19.5,32.5 18.64,31.64 IC1.7
N$19
  Bottom 0.406: Q1.3 26.81,37.01 29.6,39.8 34.8,39.8 39,39.8 39.47,40.27 JP2.2
N$20
  Bottom 0.152: JMP1.2 41.66,31.65 R16.2 R17.1
N$24  (via drill 0.35)
  Top 0.152: U1.CH_PD v81.3,32.6
  Bottom 0.152: v81.3,32.6 81.3,28.9 79.9,27.5 R21.1
N$26  (via drill 0.35)
  Top 0.152: v13.8,36.5 13.6,36.3 13.6,33.2 14.6,32.2 14.6,31.2 12.5,29.1 12.5,27.9 12.8,27.6 20.6,27.6 22.9,25.3 v30.2,25.3
  Bottom 0.152: JMP1.1 41.55,29.35 41.01,28.81 35.61,28.81 33.54,26.74 33.54,25.34 33.1,24.9 30.6,24.9 v30.2,25.3 | IC1.30 13.78,36.52 v13.8,36.5
RST_AVR  (via drill 0.35)
  Top 0.152: U$6.P5 4.04,34.14 10.1,40.2 v12.2,40.2
  Bottom 0.152: IC1.29 12.98,40.2 | 12.98,40.2 12.98,41.53 R15.1 C14.2 | v12.2,40.2 12.98,40.2
RST_ESP  (via drill 0.35)
  Top 0.152: U1.RESET v85.3,32.6
  Bottom 0.152: C13.2 85.35,32.65 v85.3,32.6 83.1,30.4 R22.1 84.75,26.25 85.91,25.09 85.91,15.21 78.1,7.4 72.8,7.4 70.8,5.4 70.8,3.9 70.5,3.6 68.7,3.6 68.33,3.23 U$5.P4
SCK
  Bottom 0.152: IC1.17 5.06,30.84 4.3,31.6 U$6.P3
SCL  (via drill 0.35)
  Top 0.152: U1.GPIO5 81.3,10.8 78.4,7.9 74.4,7.9 72.7,6.2 55.6,6.2 20.4,6.2 v19.3,5.1 | v12.5,35.3 12.5,33.3 11.8,32.6 11.8,27.2 12.2,26.8 20.33,26.8 20.8,26.33 20.8,13.51 18.9,11.6 v18.9,9
  Bottom 0.152: R13.1 13.4,3.3 14.63,4.54 IC4.6 14.63,7.83 14.9,8.1 18.6,8.1 | v19.3,5.1 19.3,7.4 18.6,8.1 | IC1.28 12.18,35.62 v12.5,35.3 | v18.9,9 18.9,8.4 18.6,8.1
SDA  (via drill 0.35)
  Top 0.152: U1.GPIO4 79.3,9.6 78,8.3 74.2,8.3 72.5,6.6 v18,6.6 18,11.2 20.5,13.7 20.5,26.2 20.3,26.4 11.87,26.4 11.4,26.87 11.4,32.6 10.8,33.2 v10.8,35.3
  Bottom 0.152: IC4.5 16.95,5.25 | 16.95,5.25 R14.1 | v18,6.6 16.95,5.55 16.95,5.25 | IC1.27 11.38,35.88 v10.8,35.3
T1  (via drill 0.35)
  Top 0.152: S1.1 S1.2 59.36,12.16 59.9,12.7 59.9,28.2 61.2,29.5 65.6,29.5 v66.7,28.4 | v77,21.6 77,24.8 79.3,27.1 U1.GPIO16
  Bottom 0.152: v66.7,28.4 68.8,28.4 74.45,22.75 75.6,21.6 v77,21.6 | R8.1 52.86,11.11 S1.1
T2  (via drill 0.35)
  Top 0.152: S2.1 46.1,9.07 | 46.1,9.07 S2.2 | 46.1,9.07 46.1,8.2 46.5,7.8 61.1,7.8 61.8,8.5 61.8,9.7 60.4,11.1 60.4,27.9 61.5,29 64.3,29 v65.2,28.1 | v75.8,20.1 75.8,24.9 77.3,26.4 U1.GPIO14
  Bottom 0.152: v65.2,28.1 66,27.3 69.3,27.3 75.8,20.8 v75.8,20.1 | R5.1 S2.1
T3  (via drill 0.35)
  Top 0.152: S3.1 36.2,9.07 | 36.2,9.07 S3.2 | 36.2,9.07 36.3,8.97 36.3,8.5 37.4,7.4 72.1,7.4 75.3,10.6 U1.GPIO2 75.3,16.4 v75.4,16.5
  Bottom 0.152: v75.4,16.5 75.45,16.55 R20.2
T4  (via drill 0.35)
  Top 0.152: S4.1 26.4,9.07 | 26.4,9.07 S4.2 | 26.4,9.07 26.4,8 27.4,7 72.3,7 74,8.7 76.8,8.7 77.3,9.2 v77.3,10 U1.GPIO0 | v72.2,8.8 v69.7,8.8 | v69.6,4.6 69.6,3.6 U$5.P3
  Bottom 0.152: R18.2 83.7,16.4 v77.3,10 76.1,8.8 v72.2,8.8 | v69.7,8.8 69.6,8.7 v69.6,4.6

### Text on the board
tPlace: PWR | LED | DMX | GND 12V | 12V B G R W | G - + G | AVR ISP | WiFi DMX RGBW Controller | SDB#021 | GND / RST / MOSI / SCK / VCC | (sdb.julian-w.de) | MISO | 12 | common anode | 1 | IR | + G R 0 R T | © 2019 by Julian Wolter | ESP8266 PROG
bPlace: SDB#021 | PWR | LED | DMX | GND | 12V | 12V | W R G B | G + - G | GND | MAX481 | AVR ISP | ATMega168 | MAX481 | MISO | 16MHz | AMS1117 / 3.3V | © 2019 by / Julian Wolter | DC-DC / StepDown / 5V | 24C08 | T R 0 R G + | more infos: github.com/julian-w/DMXHardware | Julian Wolter | WiFi DMX Controller by | ESP8266 PROG